# Altium project Miner-8Chips.PrjPcb
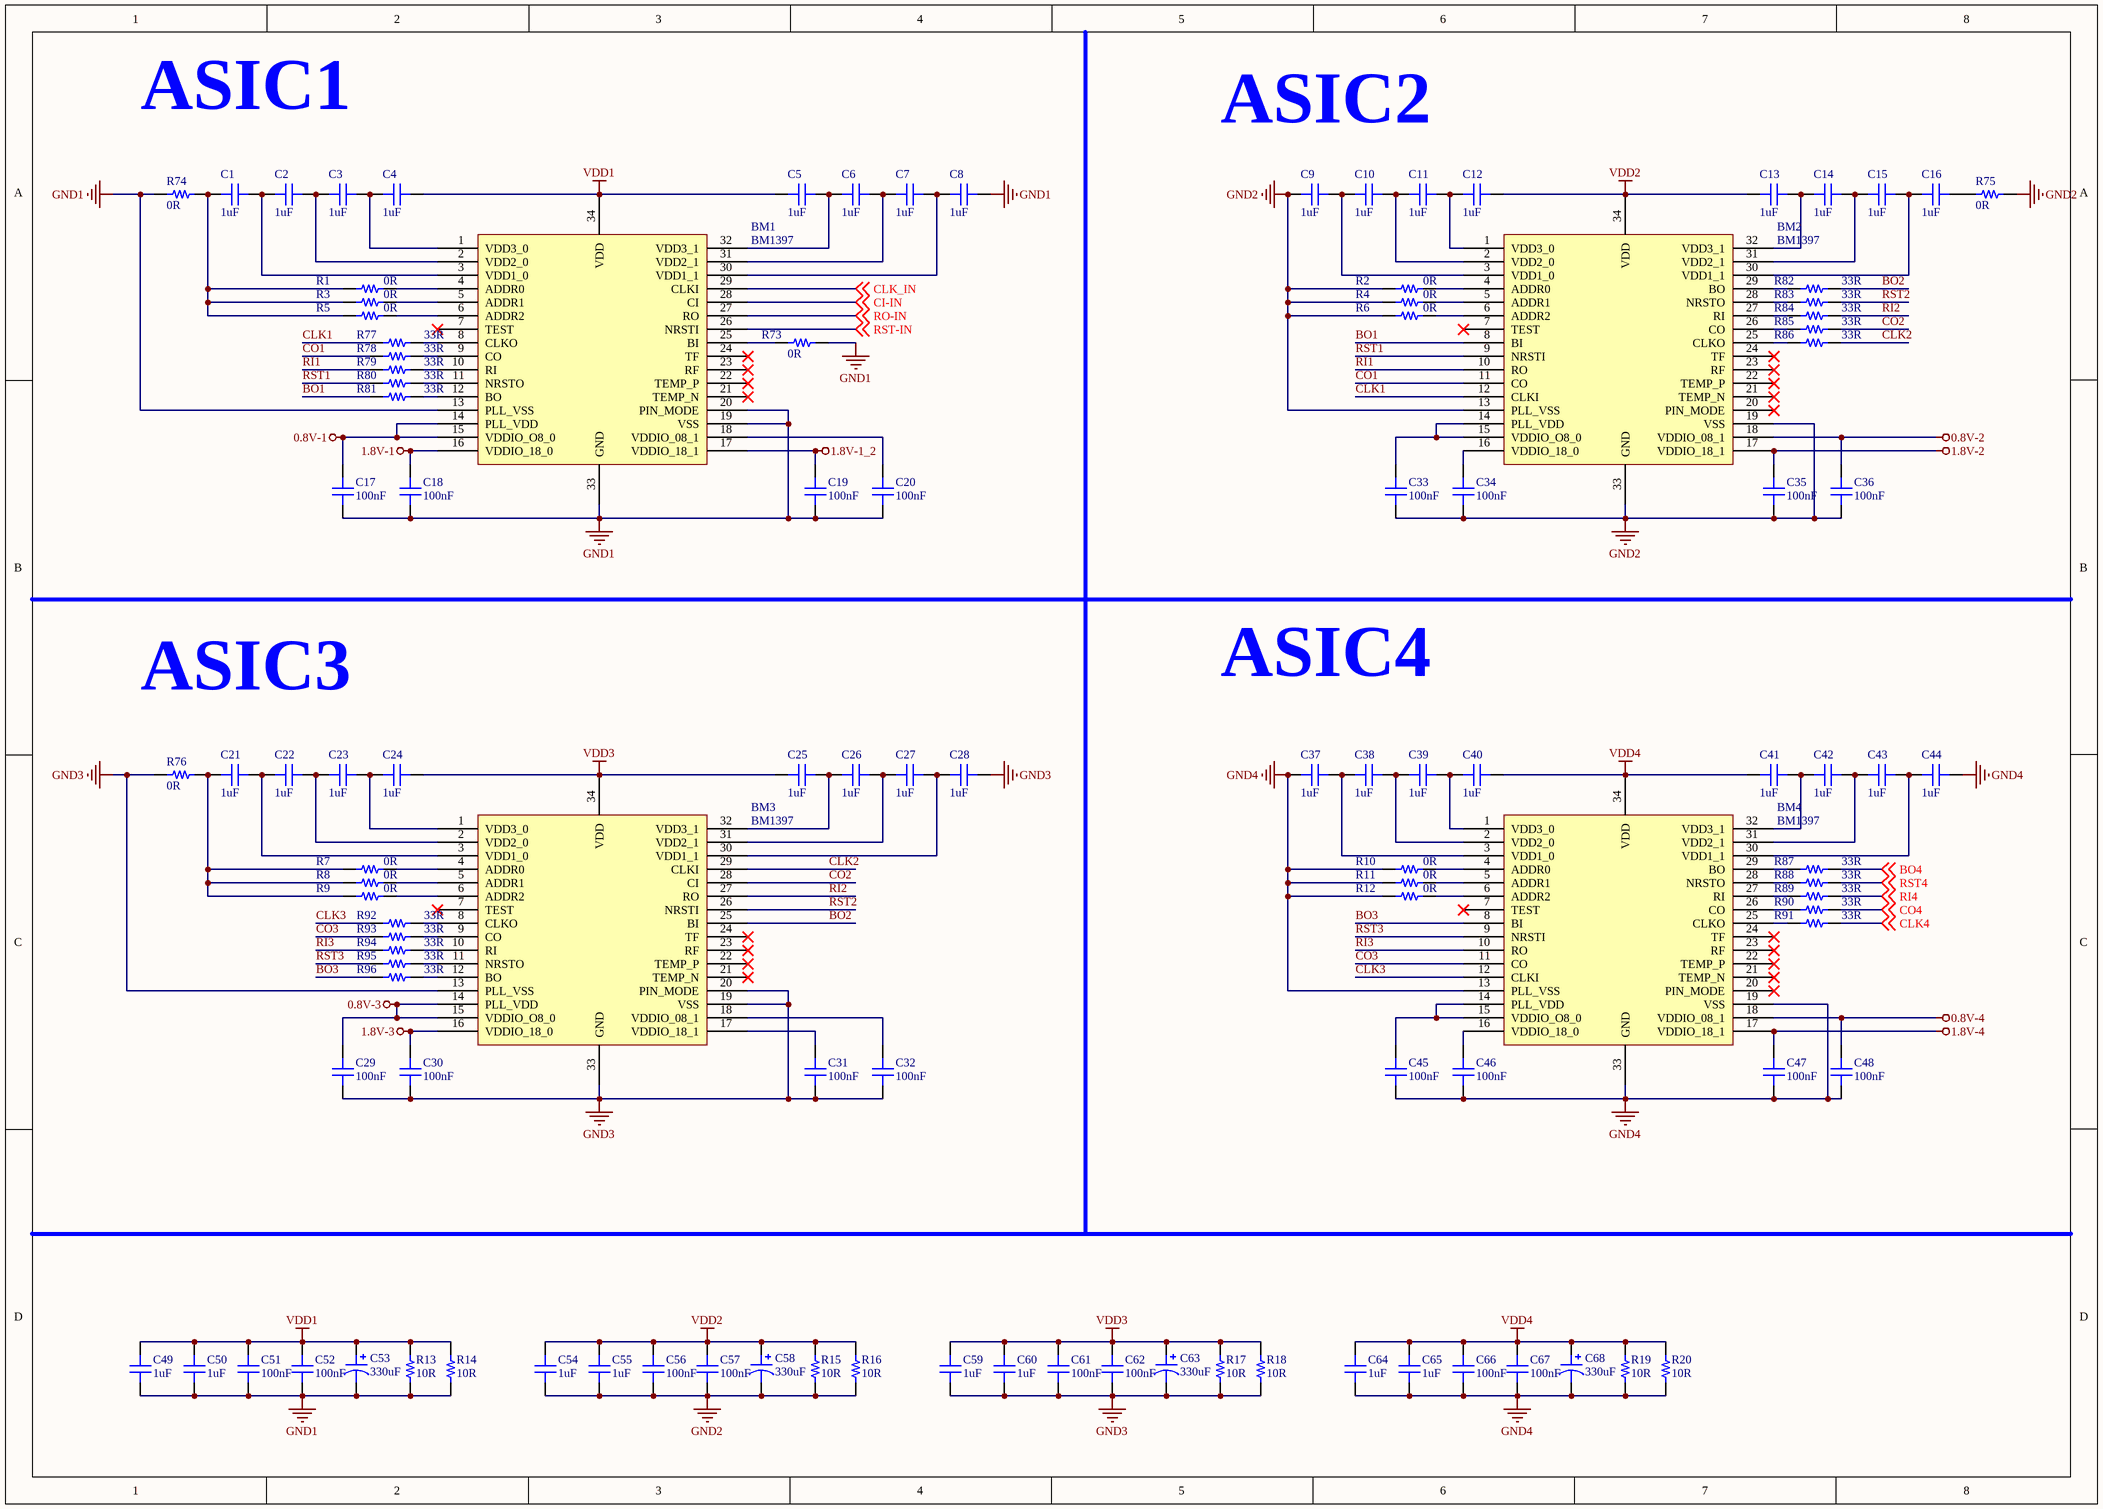
[diagram p0: BLOCK[1-4].SchDoc]
3 sheets, 329 parts. Net scope: global (net labels, ports and power ports of the same name join across sheets).
Board file: Miner-8Chips.PcbDoc
Sheets:
  BLOCK[1-4].SchDoc
  BLOCK[5-8].SchDoc
  POWER.SchDoc

## Sheet BLOCK[1-4].SchDoc
size A3; SheetNumber: 1; SheetTotal: 3

### Parts
BM1  BM1397  [BM1387]
BM2  BM1397  [BM1387]
BM3  BM1397  [BM1387]
BM4  BM1397  [BM1387]
C1  1uF  [CAP-SMD-0402]
C2  1uF  [CAP-SMD-0402]
C3  1uF  [CAP-SMD-0402]
C4  1uF  [CAP-SMD-0402]
C5  1uF  [CAP-SMD-0402]
C6  1uF  [CAP-SMD-0402]
C7  1uF  [CAP-SMD-0402]
C8  1uF  [CAP-SMD-0402]
C9  1uF  [CAP-SMD-0402]
C10  1uF  [CAP-SMD-0402]
C11  1uF  [CAP-SMD-0402]
C12  1uF  [CAP-SMD-0402]
C13  1uF  [CAP-SMD-0402]
C14  1uF  [CAP-SMD-0402]
C15  1uF  [CAP-SMD-0402]
C16  1uF  [CAP-SMD-0402]
C17  100nF  [CAP-SMD-0603]
C18  100nF  [CAP-SMD-0603]
C19  100nF  [CAP-SMD-0603]
C20  100nF  [CAP-SMD-0603]
C21  1uF  [CAP-SMD-0402]
C22  1uF  [CAP-SMD-0402]
C23  1uF  [CAP-SMD-0402]
C24  1uF  [CAP-SMD-0402]
C25  1uF  [CAP-SMD-0402]
C26  1uF  [CAP-SMD-0402]
C27  1uF  [CAP-SMD-0402]
C28  1uF  [CAP-SMD-0402]
C29  100nF  [CAP-SMD-0603]
C30  100nF  [CAP-SMD-0603]
C31  100nF  [CAP-SMD-0603]
C32  100nF  [CAP-SMD-0603]
C33  100nF  [CAP-SMD-0603]
C34  100nF  [CAP-SMD-0603]
C35  100nF  [CAP-SMD-0603]
C36  100nF  [CAP-SMD-0603]
C37  1uF  [CAP-SMD-0402]
C38  1uF  [CAP-SMD-0402]
C39  1uF  [CAP-SMD-0402]
C40  1uF  [CAP-SMD-0402]
C41  1uF  [CAP-SMD-0402]
C42  1uF  [CAP-SMD-0402]
C43  1uF  [CAP-SMD-0402]
C44  1uF  [CAP-SMD-0402]
C45  100nF  [CAP-SMD-0603]
C46  100nF  [CAP-SMD-0603]
C47  100nF  [CAP-SMD-0603]
C48  100nF  [CAP-SMD-0603]
C49  1uF  [CAP-SMD-0603]
C50  1uF  [CAP-SMD-0603]
C51  100nF  [CAP-SMD-0603]
C52  100nF  [CAP-SMD-0603]
C53  330uF  [CAP-TAN-CASE-E]
C54  1uF  [CAP-SMD-0603]
C55  1uF  [CAP-SMD-0603]
C56  100nF  [CAP-SMD-0603]
C57  100nF  [CAP-SMD-0603]
C58  330uF  [CAP-TAN-CASE-E]
C59  1uF  [CAP-SMD-0603]
C60  1uF  [CAP-SMD-0603]
C61  100nF  [CAP-SMD-0603]
C62  100nF  [CAP-SMD-0603]
C63  330uF  [CAP-TAN-CASE-E]
C64  1uF  [CAP-SMD-0603]
C65  1uF  [CAP-SMD-0603]
C66  100nF  [CAP-SMD-0603]
C67  100nF  [CAP-SMD-0603]
C68  330uF  [CAP-TAN-CASE-E]
R1  0R  [RES-SMD-0402]
R2  0R  [RES-SMD-0402]
R3  0R  [RES-SMD-0402]
R4  0R  [RES-SMD-0402]
R5  0R  [RES-SMD-0402]
R6  0R  [RES-SMD-0402]
R7  0R  [RES-SMD-0402]
R8  0R  [RES-SMD-0402]
R9  0R  [RES-SMD-0402]
R10  0R  [RES-SMD-0402]
R11  0R  [RES-SMD-0402]
R12  0R  [RES-SMD-0402]
R13  10R  [RES-SMD-1210]
R14  10R  [RES-SMD-1210]
R15  10R  [RES-SMD-1210]
R16  10R  [RES-SMD-1210]
R17  10R  [RES-SMD-1210]
R18  10R  [RES-SMD-1210]
R19  10R  [RES-SMD-1210]
R20  10R  [RES-SMD-1210]
R73  0R  [RES-SMD-0603]
R74  0R  [RES]
R75  0R  [RES]
R76  0R  [RES]
R77  33R  [RES-SMD-1206]
R78  33R  [RES-SMD-1206]
R79  33R  [RES-SMD-1206]
R80  33R  [RES-SMD-1206]
R81  33R  [RES-SMD-1206]
R82  33R  [RES-SMD-1206]
R83  33R  [RES-SMD-1206]
R84  33R  [RES-SMD-1206]
R85  33R  [RES-SMD-1206]
R86  33R  [RES-SMD-1206]
R87  33R  [RES-SMD-1206]
R88  33R  [RES-SMD-1206]
R89  33R  [RES-SMD-1206]
R90  33R  [RES-SMD-1206]
R91  33R  [RES-SMD-1206]
R92  33R  [RES-SMD-1206]
R93  33R  [RES-SMD-1206]
R94  33R  [RES-SMD-1206]
R95  33R  [RES-SMD-1206]
R96  33R  [RES-SMD-1206]

### Nets
0.8V-1: BM1.14(PLL_VDD) BM1.15(VDDIO_O8_0) C17.2
0.8V-2: BM2.18(VDDIO_08_1) C36.2
0.8V-3: BM3.14(PLL_VDD) BM3.15(VDDIO_O8_0) C29.2
0.8V-4: BM4.18(VDDIO_08_1) C48.2
1.8V-1: BM1.16(VDDIO_18_0) C18.2
1.8V-1_2: BM1.17(VDDIO_18_1) C19.2
1.8V-2: BM2.17(VDDIO_18_1) C35.2
1.8V-3: BM3.16(VDDIO_18_0) C30.2
1.8V-4: BM4.17(VDDIO_18_1) C47.2
GND1: BM1.13(PLL_VSS) BM1.19(VSS) BM1.20(PIN_MODE) BM1.33(GND) C8.2 C17.1 C18.1 C19.1 C20.1 C49.1 C50.1 C51.1 C52.1 C53.2 R13.1 R14.1 R73.2 R74.1  [project net GND]
GND2: BM1.34(VDD) BM2.13(PLL_VSS) BM2.19(VSS) BM2.33(GND) C4.2 C5.1 C9.1 C33.1 C34.1 C35.1 C36.1 C49.2 C50.2 C51.2 C52.2 C53.1 C54.1 C55.1 C56.1 C57.1 C58.2 R2.1 R4.1 R6.1 R13.2 R14.2 R15.1 R16.1 R75.2  [also labelled VDD1]
GND3: BM2.34(VDD) BM3.13(PLL_VSS) BM3.19(VSS) BM3.20(PIN_MODE) BM3.33(GND) C12.2 C13.1 C28.2 C29.1 C30.1 C31.1 C32.1 C54.2 C55.2 C56.2 C57.2 C58.1 C59.1 C60.1 C61.1 C62.1 C63.2 R15.2 R16.2 R17.1 R18.1 R76.1  [also labelled VDD2]  [project net 3.3V-1]
GND4: BM3.34(VDD) BM4.13(PLL_VSS) BM4.19(VSS) BM4.33(GND) C24.2 C25.1 C37.1 C44.2 C45.1 C46.1 C47.1 C48.1 C59.2 C60.2 C61.2 C62.2 C63.1 C64.1 C65.1 C66.1 C67.1 C68.2 R10.1 R11.1 R12.1 R17.2 R18.2 R19.1 R20.1  [also labelled VDD3]  [project net 3.3V-2]
VDD4: BM4.34(VDD) C40.2 C41.1 C64.2 C65.2 C66.2 C67.2 C68.1 R19.2 R20.2  [project net 3.3V-3]
BO1: BM2.8(BI) R81.1
BO2: BM3.25(BI) R82.2
BO3: BM4.8(BI) R96.1
BO4: R87.2 ; off-sheet BO4
CI-IN: BM1.28(CI) ; off-sheet CI-IN
CLK1: BM2.12(CLKI) R77.1
CLK2: BM3.29(CLKI) R86.2
CLK3: BM4.12(CLKI) R92.1
CLK4: R91.2 ; off-sheet CLK4
CLK_IN: BM1.29(CLKI) ; off-sheet CLK_IN
CO1: BM2.11(CO) R78.1
CO2: BM3.28(CI) R85.2
CO3: BM4.11(CO) R93.1
CO4: R90.2 ; off-sheet CO4
RI1: BM2.10(RO) R79.1
RI2: BM3.27(RO) R84.2
RI3: BM4.10(RO) R94.1
RI4: R89.2 ; off-sheet RI4
RO-IN: BM1.27(RO) ; off-sheet RO-IN
RST1: BM2.9(NRSTI) R80.1
RST2: BM3.26(NRSTI) R83.2
RST3: BM4.9(NRSTI) R95.1
RST4: R88.2 ; off-sheet RST4
RST-IN: BM1.26(NRSTI) ; off-sheet RST-IN
NetBM1_1: BM1.1(VDD3_0) C3.2 C4.1
NetBM1_2: BM1.2(VDD2_0) C2.2 C3.1
NetBM1_3: BM1.3(VDD1_0) C1.2 C2.1
NetBM1_4: BM1.4(ADDR0) R1.2
NetBM1_5: BM1.5(ADDR1) R3.2
NetBM1_6: BM1.6(ADDR2) R5.2
NetBM1_8: BM1.8(CLKO) R77.2
NetBM1_9: BM1.9(CO) R78.2
NetBM1_10: BM1.10(RI) R79.2
NetBM1_11: BM1.11(NRSTO) R80.2
NetBM1_12: BM1.12(BO) R81.2
NetBM1_18: BM1.18(VDDIO_08_1) C20.2
NetBM1_25: BM1.25(BI) R73.1
NetBM1_30: BM1.30(VDD1_1) C7.2 C8.1
NetBM1_31: BM1.31(VDD2_1) C6.2 C7.1
NetBM1_32: BM1.32(VDD3_1) C5.2 C6.1
NetBM2_1: BM2.1(VDD3_0) C11.2 C12.1
NetBM2_2: BM2.2(VDD2_0) C10.2 C11.1
NetBM2_3: BM2.3(VDD1_0) C9.2 C10.1
NetBM2_4: BM2.4(ADDR0) R2.2
NetBM2_5: BM2.5(ADDR1) R4.2
NetBM2_6: BM2.6(ADDR2) R6.2
NetBM2_14: BM2.14(PLL_VDD) BM2.15(VDDIO_O8_0) C33.2
NetBM2_16: BM2.16(VDDIO_18_0) C34.2
NetBM2_25: BM2.25(CLKO) R86.1
NetBM2_26: BM2.26(CO) R85.1
NetBM2_27: BM2.27(RI) R84.1
NetBM2_28: BM2.28(NRSTO) R83.1
NetBM2_29: BM2.29(BO) R82.1
NetBM2_30: BM2.30(VDD1_1) C15.2 C16.1
NetBM2_31: BM2.31(VDD2_1) C14.2 C15.1
NetBM2_32: BM2.32(VDD3_1) C13.2 C14.1
NetBM3_1: BM3.1(VDD3_0) C23.2 C24.1
NetBM3_2: BM3.2(VDD2_0) C22.2 C23.1
NetBM3_3: BM3.3(VDD1_0) C21.2 C22.1
NetBM3_4: BM3.4(ADDR0) R7.2
NetBM3_5: BM3.5(ADDR1) R8.2
NetBM3_6: BM3.6(ADDR2) R9.2
NetBM3_8: BM3.8(CLKO) R92.2
NetBM3_9: BM3.9(CO) R93.2
NetBM3_10: BM3.10(RI) R94.2
NetBM3_11: BM3.11(NRSTO) R95.2
NetBM3_12: BM3.12(BO) R96.2
NetBM3_17: BM3.17(VDDIO_18_1) C31.2
NetBM3_18: BM3.18(VDDIO_08_1) C32.2
NetBM3_30: BM3.30(VDD1_1) C27.2 C28.1
NetBM3_31: BM3.31(VDD2_1) C26.2 C27.1
NetBM3_32: BM3.32(VDD3_1) C25.2 C26.1
NetBM4_1: BM4.1(VDD3_0) C39.2 C40.1
NetBM4_2: BM4.2(VDD2_0) C38.2 C39.1
NetBM4_3: BM4.3(VDD1_0) C37.2 C38.1
NetBM4_4: BM4.4(ADDR0) R10.2
NetBM4_5: BM4.5(ADDR1) R11.2
NetBM4_6: BM4.6(ADDR2) R12.2
NetBM4_14: BM4.14(PLL_VDD) BM4.15(VDDIO_O8_0) C45.2
NetBM4_16: BM4.16(VDDIO_18_0) C46.2
NetBM4_25: BM4.25(CLKO) R91.1
NetBM4_26: BM4.26(CO) R90.1
NetBM4_27: BM4.27(RI) R89.1
NetBM4_28: BM4.28(NRSTO) R88.1
NetBM4_29: BM4.29(BO) R87.1
NetBM4_30: BM4.30(VDD1_1) C43.2 C44.1
NetBM4_31: BM4.31(VDD2_1) C42.2 C43.1
NetBM4_32: BM4.32(VDD3_1) C41.2 C42.1
NetC1_1: C1.1 R1.1 R3.1 R5.1 R74.2
NetC16_2: C16.2 R75.1
NetC21_1: C21.1 R7.1 R8.1 R9.1 R76.2

Not connected (* = marked no-connect by the designer): BM1 7(TEST)* 21(TEMP_N)* 22(TEMP_P)* 23(RF)* 24(TF)*; BM2 7(TEST)* 20(PIN_MODE)* 21(TEMP_N)* 22(TEMP_P)* 23(RF)* 24(TF)*; BM3 7(TEST)* 21(TEMP_N)* 22(TEMP_P)* 23(RF)* 24(TF)*; BM4 7(TEST)* 20(PIN_MODE)* 21(TEMP_N)* 22(TEMP_P)* 23(RF)* 24(TF)*

### Notes on the sheet
- ASIC1
- ASIC2
- ASIC3
- ASIC4

### Library data of the parts
BM1 BM3 = BM1397_0
BM2 BM4 = BM1397_1
C1-C52 C54-C57 C59-C62 C64-C67 = CAP
C53 C58 C63 C68 = POLARIZED CAP
R1-R20 R73-R96 = RES

## Sheet BLOCK[5-8].SchDoc
size A3; SheetNumber: 2; SheetTotal: 3
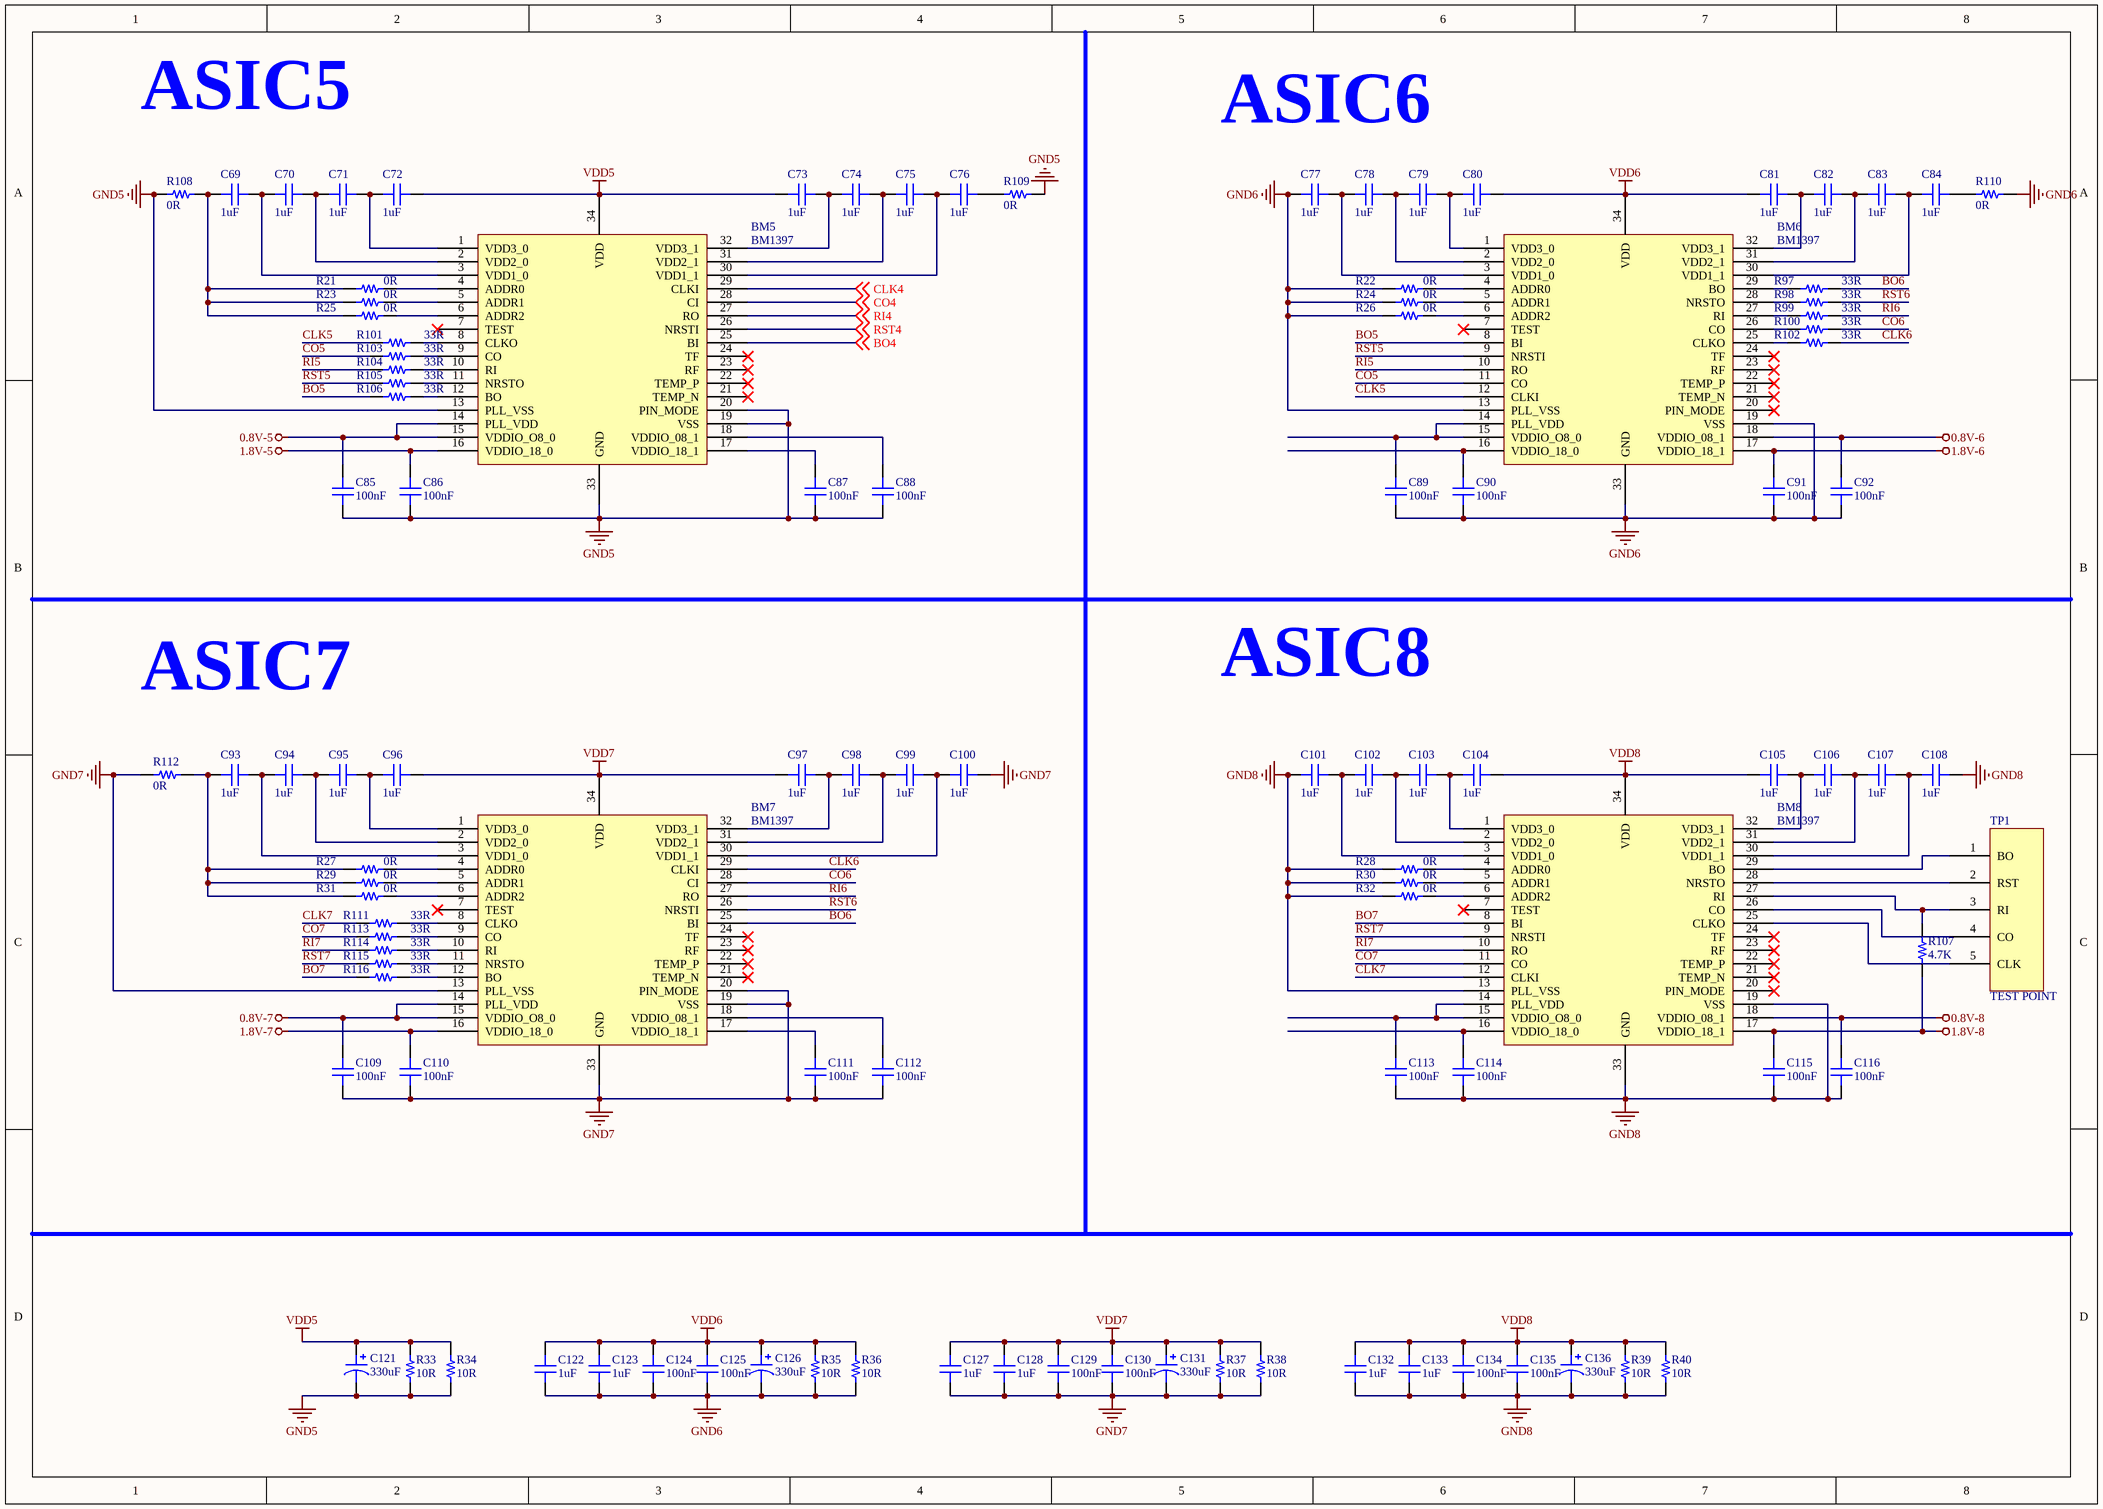
[diagram p1: BLOCK[5-8].SchDoc]

### Parts
BM5  BM1397  [BM1387]
BM6  BM1397  [BM1387]
BM7  BM1397  [BM1387]
BM8  BM1397  [BM1387]
C69  1uF  [CAP-SMD-0402]
C70  1uF  [CAP-SMD-0402]
C71  1uF  [CAP-SMD-0402]
C72  1uF  [CAP-SMD-0402]
C73  1uF  [CAP-SMD-0402]
C74  1uF  [CAP-SMD-0402]
C75  1uF  [CAP-SMD-0402]
C76  1uF  [CAP-SMD-0402]
C77  1uF  [CAP-SMD-0402]
C78  1uF  [CAP-SMD-0402]
C79  1uF  [CAP-SMD-0402]
C80  1uF  [CAP-SMD-0402]
C81  1uF  [CAP-SMD-0402]
C82  1uF  [CAP-SMD-0402]
C83  1uF  [CAP-SMD-0402]
C84  1uF  [CAP-SMD-0402]
C85  100nF  [CAP-SMD-0603]
C86  100nF  [CAP-SMD-0603]
C87  100nF  [CAP-SMD-0603]
C88  100nF  [CAP-SMD-0603]
C89  100nF  [CAP-SMD-0603]
C90  100nF  [CAP-SMD-0603]
C91  100nF  [CAP-SMD-0603]
C92  100nF  [CAP-SMD-0603]
C93  1uF  [CAP-SMD-0402]
C94  1uF  [CAP-SMD-0402]
C95  1uF  [CAP-SMD-0402]
C96  1uF  [CAP-SMD-0402]
C97  1uF  [CAP-SMD-0402]
C98  1uF  [CAP-SMD-0402]
C99  1uF  [CAP-SMD-0402]
C100  1uF  [CAP-SMD-0402]
C101  1uF  [CAP-SMD-0402]
C102  1uF  [CAP-SMD-0402]
C103  1uF  [CAP-SMD-0402]
C104  1uF  [CAP-SMD-0402]
C105  1uF  [CAP-SMD-0402]
C106  1uF  [CAP-SMD-0402]
C107  1uF  [CAP-SMD-0402]
C108  1uF  [CAP-SMD-0402]
C109  100nF  [CAP-SMD-0603]
C110  100nF  [CAP-SMD-0603]
C111  100nF  [CAP-SMD-0603]
C112  100nF  [CAP-SMD-0603]
C113  100nF  [CAP-SMD-0603]
C114  100nF  [CAP-SMD-0603]
C115  100nF  [CAP-SMD-0603]
C116  100nF  [CAP-SMD-0603]
C121  330uF  [CAP-TAN-CASE-E]
C122  1uF  [CAP-SMD-0603]
C123  1uF  [CAP-SMD-0603]
C124  100nF  [CAP-SMD-0603]
C125  100nF  [CAP-SMD-0603]
C126  330uF  [CAP-TAN-CASE-E]
C127  1uF  [CAP-SMD-0603]
C128  1uF  [CAP-SMD-0603]
C129  100nF  [CAP-SMD-0603]
C130  100nF  [CAP-SMD-0603]
C131  330uF  [CAP-TAN-CASE-E]
C132  1uF  [CAP-SMD-0603]
C133  1uF  [CAP-SMD-0603]
C134  100nF  [CAP-SMD-0603]
C135  100nF  [CAP-SMD-0603]
C136  330uF  [CAP-TAN-CASE-E]
R21  0R  [RES-SMD-0402]
R22  0R  [RES-SMD-0402]
R23  0R  [RES-SMD-0402]
R24  0R  [RES-SMD-0402]
R25  0R  [RES-SMD-0402]
R26  0R  [RES-SMD-0402]
R27  0R  [RES-SMD-0402]
R28  0R  [RES-SMD-0402]
R29  0R  [RES-SMD-0402]
R30  0R  [RES-SMD-0402]
R31  0R  [RES-SMD-0402]
R32  0R  [RES-SMD-0402]
R33  10R  [RES-SMD-1210]
R34  10R  [RES-SMD-1210]
R35  10R  [RES-SMD-1210]
R36  10R  [RES-SMD-1210]
R37  10R  [RES-SMD-1210]
R38  10R  [RES-SMD-1210]
R39  10R  [RES-SMD-1210]
R40  10R  [RES-SMD-1210]
R97  33R  [RES-SMD-1206]
R98  33R  [RES-SMD-1206]
R99  33R  [RES-SMD-1206]
R100  33R  [RES-SMD-1206]
R101  33R  [RES-SMD-1206]
R102  33R  [RES-SMD-1206]
R103  33R  [RES-SMD-1206]
R104  33R  [RES-SMD-1206]
R105  33R  [RES-SMD-1206]
R106  33R  [RES-SMD-1206]
R107  4.7K  [RES-SMD-0402]
R108  0R  [RES]
R109  0R  [RES]
R110  0R  [RES]
R111  33R  [RES-SMD-1206]
R112  0R  [RES]
R113  33R  [RES-SMD-1206]
R114  33R  [RES-SMD-1206]
R115  33R  [RES-SMD-1206]
R116  33R  [RES-SMD-1206]
TP1  TEST POINT  [TEST_POINT]

### Nets
0.8V-5: BM5.14(PLL_VDD) BM5.15(VDDIO_O8_0) C85.2
0.8V-6: BM6.18(VDDIO_08_1) C92.2
0.8V-7: BM7.14(PLL_VDD) BM7.15(VDDIO_O8_0) C109.2
0.8V-8: BM8.18(VDDIO_08_1) C116.2
1.8V-5: BM5.16(VDDIO_18_0) C86.2
1.8V-6: BM6.17(VDDIO_18_1) C91.2
1.8V-7: BM7.16(VDDIO_18_0) C110.2
1.8V-8: BM8.17(VDDIO_18_1) C115.2 R107.1
GND5: BM5.13(PLL_VSS) BM5.19(VSS) BM5.20(PIN_MODE) BM5.33(GND) C85.1 C86.1 C87.1 C88.1 C121.2 R33.1 R34.1 R108.1 R109.2  [project net 3.3V-3]
GND6: BM5.34(VDD) BM6.13(PLL_VSS) BM6.19(VSS) BM6.33(GND) C72.2 C73.1 C77.1 C89.1 C90.1 C91.1 C92.1 C121.1 C122.1 C123.1 C124.1 C125.1 C126.2 R22.1 R24.1 R26.1 R33.2 R34.2 R35.1 R36.1 R110.2  [also labelled VDD5]  [project net 3.3V-4]
GND7: BM6.34(VDD) BM7.13(PLL_VSS) BM7.19(VSS) BM7.20(PIN_MODE) BM7.33(GND) C80.2 C81.1 C100.2 C109.1 C110.1 C111.1 C112.1 C122.2 C123.2 C124.2 C125.2 C126.1 C127.1 C128.1 C129.1 C130.1 C131.2 R35.2 R36.2 R37.1 R38.1 R112.1  [also labelled VDD6]  [project net 3.3V-5]
GND8: BM7.34(VDD) BM8.13(PLL_VSS) BM8.19(VSS) BM8.33(GND) C96.2 C97.1 C101.1 C108.2 C113.1 C114.1 C115.1 C116.1 C127.2 C128.2 C129.2 C130.2 C131.1 C132.1 C133.1 C134.1 C135.1 C136.2 R28.1 R30.1 R32.1 R37.2 R38.2 R39.1 R40.1  [also labelled VDD7]  [project net 3.3V-6]
VDD8: BM8.34(VDD) C104.2 C105.1 C132.2 C133.2 C134.2 C135.2 C136.1 R39.2 R40.2  [project net 3.3V-7]
BO4: BM5.25(BI) ; off-sheet BO4
BO5: BM6.8(BI) R106.1
BO6: BM7.25(BI) R97.2
BO7: BM8.8(BI) R116.1
CLK4: BM5.29(CLKI) ; off-sheet CLK4
CLK5: BM6.12(CLKI) R101.1
CLK6: BM7.29(CLKI) R102.2
CLK7: BM8.12(CLKI) R111.1
CO4: BM5.28(CI) ; off-sheet CO4
CO5: BM6.11(CO) R103.1
CO6: BM7.28(CI) R100.2
CO7: BM8.11(CO) R113.1
RI4: BM5.27(RO) ; off-sheet RI4
RI5: BM6.10(RO) R104.1
RI6: BM7.27(RO) R99.2
RI7: BM8.10(RO) R114.1
RST4: BM5.26(NRSTI) ; off-sheet RST4
RST5: BM6.9(NRSTI) R105.1
RST6: BM7.26(NRSTI) R98.2
RST7: BM8.9(NRSTI) R115.1
NetBM5_1: BM5.1(VDD3_0) C71.2 C72.1
NetBM5_2: BM5.2(VDD2_0) C70.2 C71.1
NetBM5_3: BM5.3(VDD1_0) C69.2 C70.1
NetBM5_4: BM5.4(ADDR0) R21.2
NetBM5_5: BM5.5(ADDR1) R23.2
NetBM5_6: BM5.6(ADDR2) R25.2
NetBM5_8: BM5.8(CLKO) R101.2
NetBM5_9: BM5.9(CO) R103.2
NetBM5_10: BM5.10(RI) R104.2
NetBM5_11: BM5.11(NRSTO) R105.2
NetBM5_12: BM5.12(BO) R106.2
NetBM5_17: BM5.17(VDDIO_18_1) C87.2
NetBM5_18: BM5.18(VDDIO_08_1) C88.2
NetBM5_30: BM5.30(VDD1_1) C75.2 C76.1
NetBM5_31: BM5.31(VDD2_1) C74.2 C75.1
NetBM5_32: BM5.32(VDD3_1) C73.2 C74.1
NetBM6_1: BM6.1(VDD3_0) C79.2 C80.1
NetBM6_2: BM6.2(VDD2_0) C78.2 C79.1
NetBM6_3: BM6.3(VDD1_0) C77.2 C78.1
NetBM6_4: BM6.4(ADDR0) R22.2
NetBM6_5: BM6.5(ADDR1) R24.2
NetBM6_6: BM6.6(ADDR2) R26.2
NetBM6_14: BM6.14(PLL_VDD) BM6.15(VDDIO_O8_0) C89.2
NetBM6_16: BM6.16(VDDIO_18_0) C90.2
NetBM6_25: BM6.25(CLKO) R102.1
NetBM6_26: BM6.26(CO) R100.1
NetBM6_27: BM6.27(RI) R99.1
NetBM6_28: BM6.28(NRSTO) R98.1
NetBM6_29: BM6.29(BO) R97.1
NetBM6_30: BM6.30(VDD1_1) C83.2 C84.1
NetBM6_31: BM6.31(VDD2_1) C82.2 C83.1
NetBM6_32: BM6.32(VDD3_1) C81.2 C82.1
NetBM7_1: BM7.1(VDD3_0) C95.2 C96.1
NetBM7_2: BM7.2(VDD2_0) C94.2 C95.1
NetBM7_3: BM7.3(VDD1_0) C93.2 C94.1
NetBM7_4: BM7.4(ADDR0) R27.2
NetBM7_5: BM7.5(ADDR1) R29.2
NetBM7_6: BM7.6(ADDR2) R31.2
NetBM7_8: BM7.8(CLKO) R111.2
NetBM7_9: BM7.9(CO) R113.2
NetBM7_10: BM7.10(RI) R114.2
NetBM7_11: BM7.11(NRSTO) R115.2
NetBM7_12: BM7.12(BO) R116.2
NetBM7_17: BM7.17(VDDIO_18_1) C111.2
NetBM7_18: BM7.18(VDDIO_08_1) C112.2
NetBM7_30: BM7.30(VDD1_1) C99.2 C100.1
NetBM7_31: BM7.31(VDD2_1) C98.2 C99.1
NetBM7_32: BM7.32(VDD3_1) C97.2 C98.1
NetBM8_1: BM8.1(VDD3_0) C103.2 C104.1
NetBM8_2: BM8.2(VDD2_0) C102.2 C103.1
NetBM8_3: BM8.3(VDD1_0) C101.2 C102.1
NetBM8_4: BM8.4(ADDR0) R28.2
NetBM8_5: BM8.5(ADDR1) R30.2
NetBM8_6: BM8.6(ADDR2) R32.2
NetBM8_14: BM8.14(PLL_VDD) BM8.15(VDDIO_O8_0) C113.2
NetBM8_16: BM8.16(VDDIO_18_0) C114.2
NetBM8_25: BM8.25(CLKO) TP1.5(CLK)
NetBM8_26: BM8.26(CO) TP1.4(CO)
NetBM8_27: BM8.27(RI) R107.2 TP1.3(RI)
NetBM8_28: BM8.28(NRSTO) TP1.2(RST)
NetBM8_29: BM8.29(BO) TP1.1(BO)
NetBM8_30: BM8.30(VDD1_1) C107.2 C108.1
NetBM8_31: BM8.31(VDD2_1) C106.2 C107.1
NetBM8_32: BM8.32(VDD3_1) C105.2 C106.1
NetC69_1: C69.1 R21.1 R23.1 R25.1 R108.2
NetC76_2: C76.2 R109.1
NetC84_2: C84.2 R110.1
NetC93_1: C93.1 R27.1 R29.1 R31.1 R112.2

Not connected (* = marked no-connect by the designer): BM5 7(TEST)* 21(TEMP_N)* 22(TEMP_P)* 23(RF)* 24(TF)*; BM6 7(TEST)* 20(PIN_MODE)* 21(TEMP_N)* 22(TEMP_P)* 23(RF)* 24(TF)*; BM7 7(TEST)* 21(TEMP_N)* 22(TEMP_P)* 23(RF)* 24(TF)*; BM8 7(TEST)* 20(PIN_MODE)* 21(TEMP_N)* 22(TEMP_P)* 23(RF)* 24(TF)*

### Notes on the sheet
- ASIC5
- ASIC6
- ASIC7
- ASIC8

### Library data of the parts
BM5 BM7 = BM1397_0
BM6 BM8 = BM1397_1
C69-C116 C122-C125 C127-C130 C132-C135 = CAP
C121 C126 C131 C136 = POLARIZED CAP
R21-R40 R97-R116 = RES

## Sheet POWER.SchDoc
size A3; SheetNumber: 3; SheetTotal: 3
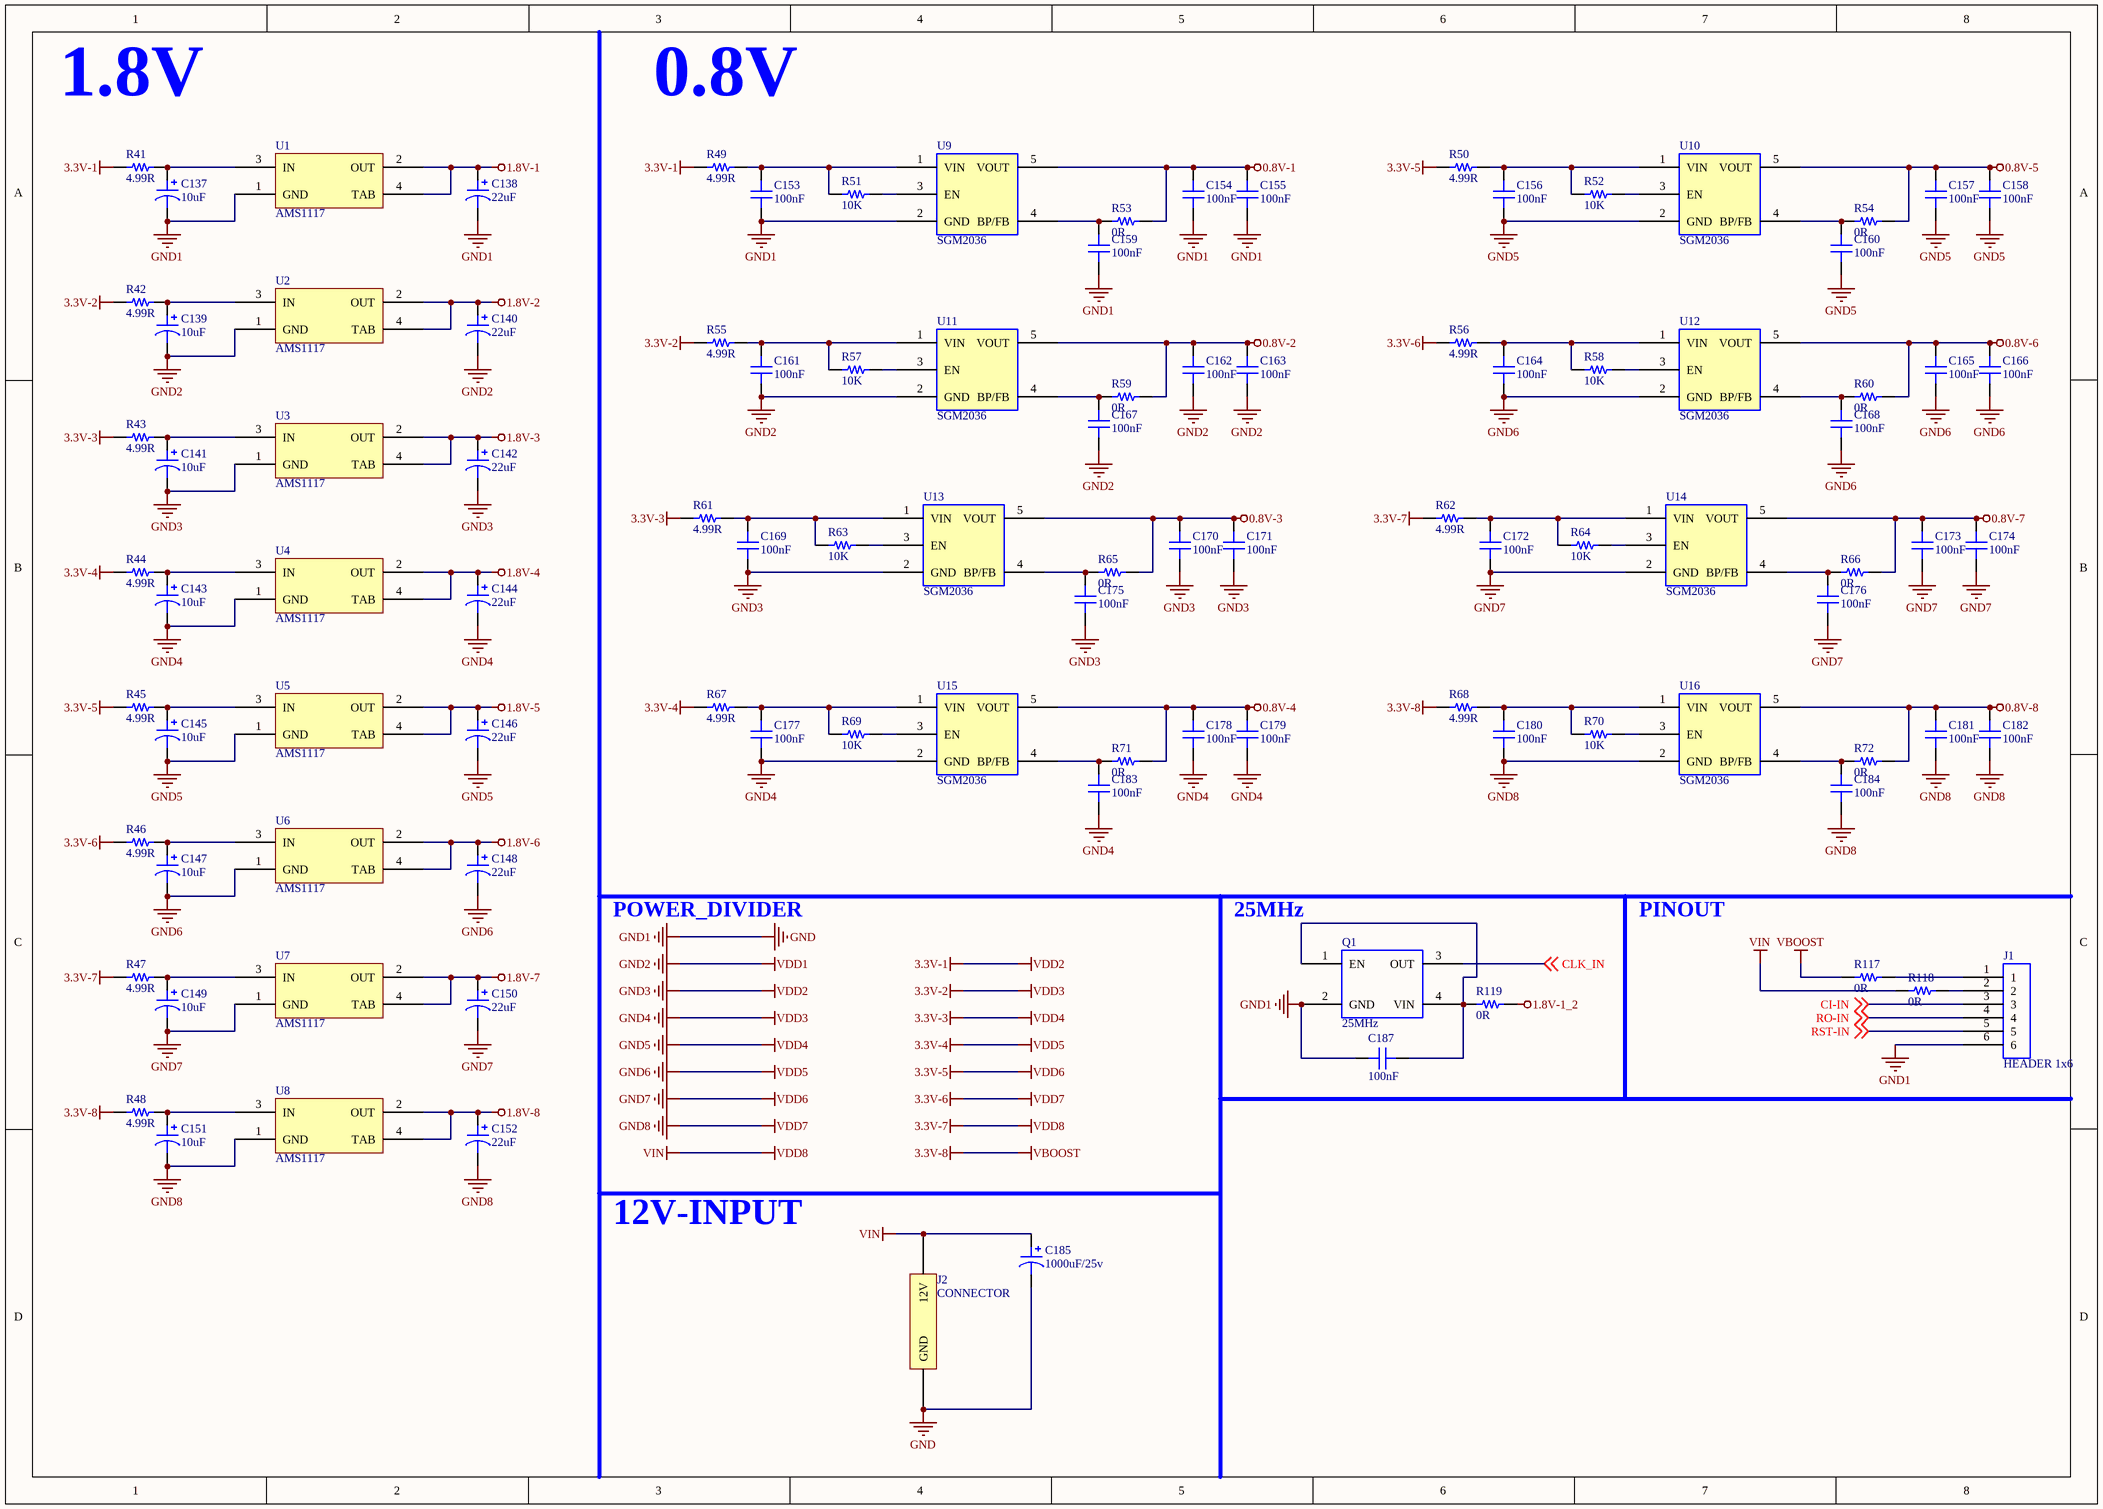
[diagram p2: POWER.SchDoc]

### Parts
C137  10uF  [CAP-TAN-CASE-A]
C138  22uF  [CAP-TAN-CASE-A]
C139  10uF  [CAP-TAN-CASE-A]
C140  22uF  [CAP-TAN-CASE-A]
C141  10uF  [CAP-TAN-CASE-A]
C142  22uF  [CAP-TAN-CASE-A]
C143  10uF  [CAP-TAN-CASE-A]
C144  22uF  [CAP-TAN-CASE-A]
C145  10uF  [CAP-TAN-CASE-A]
C146  22uF  [CAP-TAN-CASE-A]
C147  10uF  [CAP-TAN-CASE-A]
C148  22uF  [CAP-TAN-CASE-A]
C149  10uF  [CAP-TAN-CASE-A]
C150  22uF  [CAP-TAN-CASE-A]
C151  10uF  [CAP-TAN-CASE-A]
C152  22uF  [CAP-TAN-CASE-A]
C153  100nF  [CAP-SMD-0402]
C154  100nF  [CAP-SMD-0402]
C155  100nF  [CAP-SMD-0402]
C156  100nF  [CAP-SMD-0402]
C157  100nF  [CAP-SMD-0402]
C158  100nF  [CAP-SMD-0402]
C159  100nF  [CAP-SMD-0402]
C160  100nF  [CAP-SMD-0402]
C161  100nF  [CAP-SMD-0402]
C162  100nF  [CAP-SMD-0402]
C163  100nF  [CAP-SMD-0402]
C164  100nF  [CAP-SMD-0402]
C165  100nF  [CAP-SMD-0402]
C166  100nF  [CAP-SMD-0402]
C167  100nF  [CAP-SMD-0402]
C168  100nF  [CAP-SMD-0402]
C169  100nF  [CAP-SMD-0402]
C170  100nF  [CAP-SMD-0402]
C171  100nF  [CAP-SMD-0402]
C172  100nF  [CAP-SMD-0402]
C173  100nF  [CAP-SMD-0402]
C174  100nF  [CAP-SMD-0402]
C175  100nF  [CAP-SMD-0402]
C176  100nF  [CAP-SMD-0402]
C177  100nF  [CAP-SMD-0402]
C178  100nF  [CAP-SMD-0402]
C179  100nF  [CAP-SMD-0402]
C180  100nF  [CAP-SMD-0402]
C181  100nF  [CAP-SMD-0402]
C182  100nF  [CAP-SMD-0402]
C183  100nF  [CAP-SMD-0402]
C184  100nF  [CAP-SMD-0402]
C185  1000uF/25v  [CAP ALUM 10.3MM]
C187  100nF  [CAP-SMD-0603]
J1  HEADER 1x6  [HEADER-1x6]
J2  CONNECTOR  [ATX 6]
Q1  25MHz  [XTALL]
R41  4.99R  [RES-SMD-1206]
R42  4.99R  [RES-SMD-1206]
R43  4.99R  [RES-SMD-1206]
R44  4.99R  [RES-SMD-1206]
R45  4.99R  [RES-SMD-1206]
R46  4.99R  [RES-SMD-1206]
R47  4.99R  [RES-SMD-1206]
R48  4.99R  [RES-SMD-1206]
R49  4.99R  [RES-SMD-1206]
R50  4.99R  [RES-SMD-1206]
R51  10K  [RES-SMD-0402]
R52  10K  [RES-SMD-0402]
R53  0R  [RES-SMD-0402]
R54  0R  [RES-SMD-0402]
R55  4.99R  [RES-SMD-1206]
R56  4.99R  [RES-SMD-1206]
R57  10K  [RES-SMD-0402]
R58  10K  [RES-SMD-0402]
R59  0R  [RES-SMD-0402]
R60  0R  [RES-SMD-0402]
R61  4.99R  [RES-SMD-1206]
R62  4.99R  [RES-SMD-1206]
R63  10K  [RES-SMD-0402]
R64  10K  [RES-SMD-0402]
R65  0R  [RES-SMD-0402]
R66  0R  [RES-SMD-0402]
R67  4.99R  [RES-SMD-1206]
R68  4.99R  [RES-SMD-1206]
R69  10K  [RES-SMD-0402]
R70  10K  [RES-SMD-0402]
R71  0R  [RES-SMD-0402]
R72  0R  [RES-SMD-0402]
R117  0R  [RES]
R118  0R  [RES]
R119  0R  [RES]
U1  AMS1117  [AMS1117]
U2  AMS1117  [AMS1117]
U3  AMS1117  [AMS1117]
U4  AMS1117  [AMS1117]
U5  AMS1117  [AMS1117]
U6  AMS1117  [AMS1117]
U7  AMS1117  [AMS1117]
U8  AMS1117  [AMS1117]
U9  SGM2036  [SOT23-5PIN]
U10  SGM2036  [SOT23-5PIN]
U11  SGM2036  [SOT23-5PIN]
U12  SGM2036  [SOT23-5PIN]
U13  SGM2036  [SOT23-5PIN]
U14  SGM2036  [SOT23-5PIN]
U15  SGM2036  [SOT23-5PIN]
U16  SGM2036  [SOT23-5PIN]

### Nets
0.8V-1: C154.2 C155.2 R53.2 U9.5(VOUT)
0.8V-2: C162.2 C163.2 R59.2 U11.5(VOUT)
0.8V-3: C170.2 C171.2 R65.2 U13.5(VOUT)
0.8V-4: C178.2 C179.2 R71.2 U15.5(VOUT)
0.8V-5: C157.2 C158.2 R54.2 U10.5(VOUT)
0.8V-6: C165.2 C166.2 R60.2 U12.5(VOUT)
0.8V-7: C173.2 C174.2 R66.2 U14.5(VOUT)
0.8V-8: C181.2 C182.2 R72.2 U16.5(VOUT)
1.8V-1: C138.1 U1.2(OUT) U1.4(TAB)
1.8V-1_2: R119.2
1.8V-2: C140.1 U2.2(OUT) U2.4(TAB)
1.8V-3: C142.1 U3.2(OUT) U3.4(TAB)
1.8V-4: C144.1 U4.2(OUT) U4.4(TAB)
1.8V-5: C146.1 U5.2(OUT) U5.4(TAB)
1.8V-6: C148.1 U6.2(OUT) U6.4(TAB)
1.8V-7: C150.1 U7.2(OUT) U7.4(TAB)
1.8V-8: C152.1 U8.2(OUT) U8.4(TAB)
3.3V-1: C141.2 C142.2 C169.1 C170.1 C171.1 C175.1 R41.1 R49.1 U3.1(GND) U13.2(GND)  [also labelled GND3, VDD2]
3.3V-2: C143.2 C144.2 C177.1 C178.1 C179.1 C183.1 R42.1 R55.1 U4.1(GND) U15.2(GND)  [also labelled GND4, VDD3]
3.3V-3: C145.2 C146.2 C156.1 C157.1 C158.1 C160.1 R43.1 R61.1 U5.1(GND) U10.2(GND)  [also labelled GND5, VDD4]
3.3V-4: C147.2 C148.2 C164.1 C165.1 C166.1 C168.1 R44.1 R67.1 U6.1(GND) U12.2(GND)  [also labelled GND6, VDD5]
3.3V-5: C149.2 C150.2 C172.1 C173.1 C174.1 C176.1 R45.1 R50.1 U7.1(GND) U14.2(GND)  [also labelled GND7, VDD6]
3.3V-6: C151.2 C152.2 C180.1 C181.1 C182.1 C184.1 R46.1 R56.1 U8.1(GND) U16.2(GND)  [also labelled GND8, VDD7]
3.3V-7: C185.1 J2.2(12V) R47.1 R62.1 R118.1  [also labelled VDD8, VIN]
3.3V-8: R48.1 R68.1 R117.1  [also labelled VBOOST]
GND: C137.2 C138.2 C153.1 C154.1 C155.1 C159.1 C185.2 C187.2 J1.6 J2.1(GND) Q1.2(GND) U1.1(GND) U9.2(GND)  [also labelled GND1]
GND2: C139.2 C140.2 C161.1 C162.1 C163.1 C167.1 U2.1(GND) U11.2(GND)  [also labelled VDD1]
CI-IN: J1.3 ; off-sheet CI-IN
CLK_IN: Q1.3(OUT) ; off-sheet CLK_IN
RO-IN: J1.4 ; off-sheet RO-IN
RST-IN: J1.5 ; off-sheet RST-IN
NetC137_1: C137.1 R41.2 U1.3(IN)
NetC139_1: C139.1 R42.2 U2.3(IN)
NetC141_1: C141.1 R43.2 U3.3(IN)
NetC143_1: C143.1 R44.2 U4.3(IN)
NetC145_1: C145.1 R45.2 U5.3(IN)
NetC147_1: C147.1 R46.2 U6.3(IN)
NetC149_1: C149.1 R47.2 U7.3(IN)
NetC151_1: C151.1 R48.2 U8.3(IN)
NetC153_2: C153.2 R49.2 R51.1 U9.1(VIN)
NetC156_2: C156.2 R50.2 R52.1 U10.1(VIN)
NetC159_2: C159.2 R53.1 U9.4(BP/FB)
NetC160_2: C160.2 R54.1 U10.4(BP/FB)
NetC161_2: C161.2 R55.2 R57.1 U11.1(VIN)
NetC164_2: C164.2 R56.2 R58.1 U12.1(VIN)
NetC167_2: C167.2 R59.1 U11.4(BP/FB)
NetC168_2: C168.2 R60.1 U12.4(BP/FB)
NetC169_2: C169.2 R61.2 R63.1 U13.1(VIN)
NetC172_2: C172.2 R62.2 R64.1 U14.1(VIN)
NetC175_2: C175.2 R65.1 U13.4(BP/FB)
NetC176_2: C176.2 R66.1 U14.4(BP/FB)
NetC177_2: C177.2 R67.2 R69.1 U15.1(VIN)
NetC180_2: C180.2 R68.2 R70.1 U16.1(VIN)
NetC183_2: C183.2 R71.1 U15.4(BP/FB)
NetC184_2: C184.2 R72.1 U16.4(BP/FB)
NetC187_1: C187.1 Q1.1(EN) Q1.4(VIN) R119.1
NetJ1_1: J1.1 R117.2
NetJ1_2: J1.2 R118.2
NetR51_2: R51.2 U9.3(EN)
NetR52_2: R52.2 U10.3(EN)
NetR57_2: R57.2 U11.3(EN)
NetR58_2: R58.2 U12.3(EN)
NetR63_2: R63.2 U13.3(EN)
NetR64_2: R64.2 U14.3(EN)
NetR69_2: R69.2 U15.3(EN)
NetR70_2: R70.2 U16.3(EN)

### Notes on the sheet
- 1.8V
- 0.8V
- POWER_DIVIDER
- 25MHz
- PINOUT
- 12V-INPUT

### Library data of the parts
C137-C152 C185 = POLARIZED CAP
C153-C184 C187 = CAP
J2 = ATX 6
Q1 = OSCILLATOR
R41-R72 R117-R119 = RES

## Nets that join several sheets
0.8V-1: BLOCK[1-4] (BM1.14 BM1.15 C17.2), POWER (C154.2 C155.2 R53.2 U9.5)
0.8V-2: BLOCK[1-4] (BM2.18 C36.2), POWER (C162.2 C163.2 R59.2 U11.5)
0.8V-3: BLOCK[1-4] (BM3.14 BM3.15 C29.2), POWER (C170.2 C171.2 R65.2 U13.5)
0.8V-4: BLOCK[1-4] (BM4.18 C48.2), POWER (C178.2 C179.2 R71.2 U15.5)
0.8V-5: BLOCK[5-8] (BM5.14 BM5.15 C85.2), POWER (C157.2 C158.2 R54.2 U10.5)
0.8V-6: BLOCK[5-8] (BM6.18 C92.2), POWER (C165.2 C166.2 R60.2 U12.5)
0.8V-7: BLOCK[5-8] (BM7.14 BM7.15 C109.2), POWER (C173.2 C174.2 R66.2 U14.5)
0.8V-8: BLOCK[5-8] (BM8.18 C116.2), POWER (C181.2 C182.2 R72.2 U16.5)
1.8V-1: BLOCK[1-4] (BM1.16 C18.2), POWER (C138.1 U1.2 U1.4)
1.8V-1_2: BLOCK[1-4] (BM1.17 C19.2), POWER (R119.2)
1.8V-2: BLOCK[1-4] (BM2.17 C35.2), POWER (C140.1 U2.2 U2.4)
1.8V-3: BLOCK[1-4] (BM3.16 C30.2), POWER (C142.1 U3.2 U3.4)
1.8V-4: BLOCK[1-4] (BM4.17 C47.2), POWER (C144.1 U4.2 U4.4)
1.8V-5: BLOCK[5-8] (BM5.16 C86.2), POWER (C146.1 U5.2 U5.4)
1.8V-6: BLOCK[5-8] (BM6.17 C91.2), POWER (C148.1 U6.2 U6.4)
1.8V-7: BLOCK[5-8] (BM7.16 C110.2), POWER (C150.1 U7.2 U7.4)
1.8V-8: BLOCK[5-8] (BM8.17 C115.2 R107.1), POWER (C152.1 U8.2 U8.4)
3.3V-1: BLOCK[1-4] (27 pins), POWER (10 pins)
3.3V-2: BLOCK[1-4] (29 pins), POWER (10 pins)
3.3V-3: BLOCK[1-4] (10 pins), BLOCK[5-8] (13 pins), POWER (10 pins)
3.3V-4: BLOCK[5-8] (25 pins), POWER (10 pins)
3.3V-5: BLOCK[5-8] (27 pins), POWER (10 pins)
3.3V-6: BLOCK[5-8] (29 pins), POWER (10 pins)
3.3V-7: BLOCK[5-8] (10 pins), POWER (5 pins)
GND: BLOCK[1-4] (18 pins), POWER (13 pins)
GND2: BLOCK[1-4] (29 pins), POWER (8 pins)
BO4: BLOCK[1-4] (R87.2), BLOCK[5-8] (BM5.25)
CI-IN: BLOCK[1-4] (BM1.28), POWER (J1.3)
CLK4: BLOCK[1-4] (R91.2), BLOCK[5-8] (BM5.29)
CLK_IN: BLOCK[1-4] (BM1.29), POWER (Q1.3)
CO4: BLOCK[1-4] (R90.2), BLOCK[5-8] (BM5.28)
RI4: BLOCK[1-4] (R89.2), BLOCK[5-8] (BM5.27)
RO-IN: BLOCK[1-4] (BM1.27), POWER (J1.4)
RST4: BLOCK[1-4] (R88.2), BLOCK[5-8] (BM5.26)
RST-IN: BLOCK[1-4] (BM1.26), POWER (J1.5)